# Altium schematic sheet bee.SchDoc: Bee connection
size A4; DocumentNumber: 9; SheetNumber: 9; SheetTotal: 9
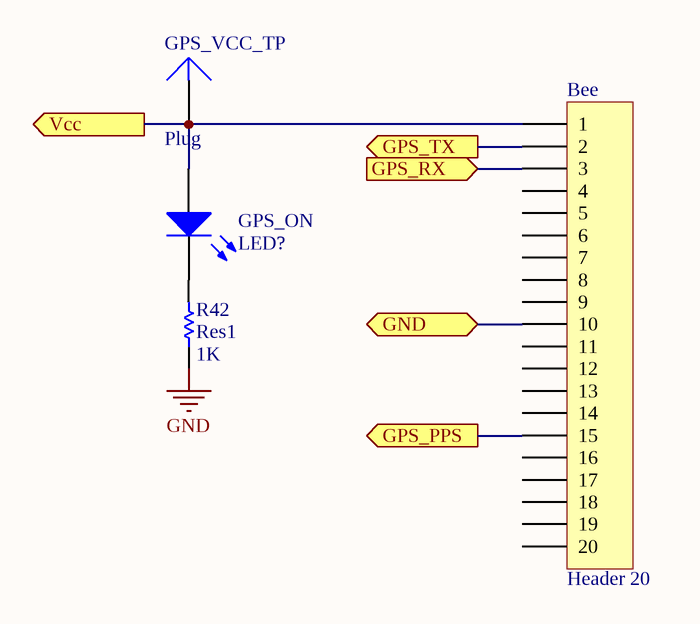
[diagram p0: bee.SchDoc]

## Parts
Bee  Header 20  [BeeSlot]
GPS_ON  LED?  [C0603]
GPS_VCC_TP  Plug  [PIN1]
R42  Res1  value 1K  [R0603]

## Ports
GND, GPS_PPS (out), GPS_RX (in), GPS_TX (out), Vcc (out)

## Nets
GND: R42.1
GND: Bee.10 ; port GND  [a separate net that carries the same name]
GPS_PPS: Bee.15 ; port GPS_PPS
GPS_RX: Bee.3 ; port GPS_RX
GPS_TX: Bee.2 ; port GPS_TX
Vcc: Bee.1 GPS_ON.1(A) GPS_VCC_TP.1 ; port Vcc
NetGPS_ON_2: GPS_ON.2(K) R42.2

Not connected (* = marked no-connect by the designer): Bee 4 5 6 7 8 9 11 12 13 14 16 17 18 19 20

## Notes on the sheet
- Title
- Size:
- Date:
- A4
- Number:
- Time:
- Revision:
- Sheet
- of
- The Things Products
- Project:
- File:

## Library data of the parts
Bee = Header 20: Header, 20-Pin; LatestRevisionDate: 17-Jul-2002; LatestRevisionNote: Re-released for DXP Platform.; Publisher: Altium Limited
GPS_ON = LED0: Typical INFRARED GaAs LED; Published: 8-Jun-2000; LatestRevisionDate: 08-Jul-2005; LatestRevisionNote: Mech Layer 1 removed.; PackageReference: LED-0; Publisher: Altium Limited; PackageDescription: LED; 2 Leads
R42 = Res1: Resistor; Published: 8-Jun-2000; LatestRevisionDate: 17-Jul-2002; LatestRevisionNote: Re-released for DXP Platform.; PackageReference: AXIAL-0.3; Publisher: Altium Limited; PackageDescription: Axial Device, Thru-Hole; 2 Leads; 0.3 in Pin Spacing
GPS_VCC_TP = Plug: LatestRevisionDate: 17-Jul-2002; LatestRevisionNote: Re-released for DXP Platform.; Publisher: Altium Limited